# EAGLE design R284X (EAGLE 6.6.0)
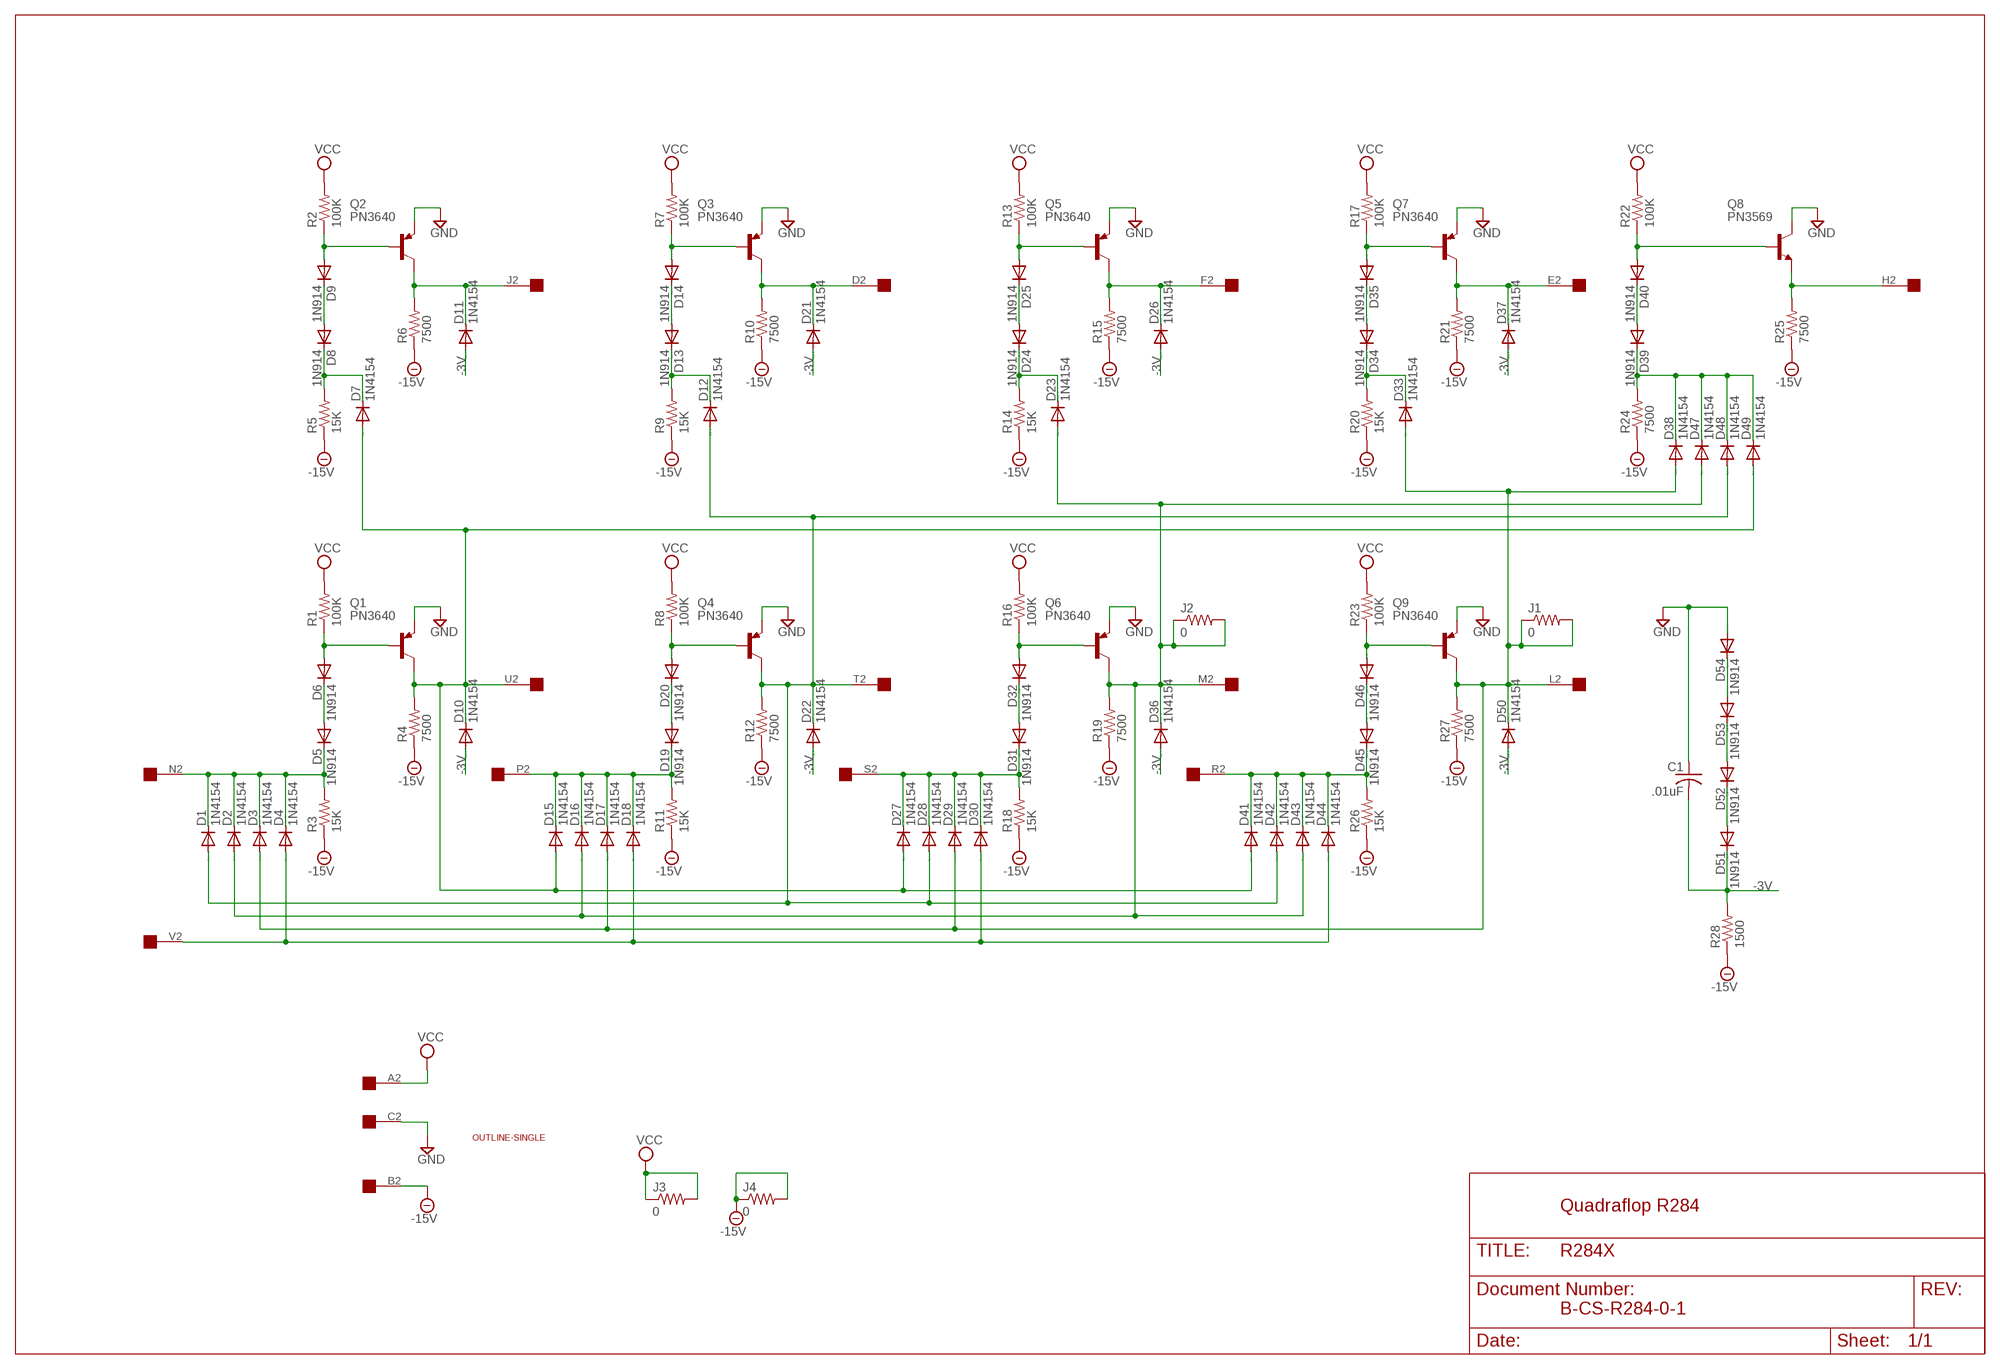
[diagram p0: schematic, sheet 1]

## Parts
C1  .01uF  C-US  [C063-025X075]
D1  1N4154  DIODE-DO35-10  [DO35-10]
D2  1N4154  DIODE-DO35-10  [DO35-10]
D3  1N4154  DIODE-DO35-10  [DO35-10]
D4  1N4154  DIODE-DO35-10  [DO35-10]
D5  1N914  DIODE-DO35-10  [DO35-10]
D6  1N914  DIODE-DO35-10  [DO35-10]
D7  1N4154  DIODE-DO35-10  [DO35-10]
D8  1N914  DIODE-DO35-10  [DO35-10]
D9  1N914  DIODE-DO35-10  [DO35-10]
D10  1N4154  DIODE-DO35-10  [DO35-10]
D11  1N4154  DIODE-DO35-10  [DO35-10]
D12  1N4154  DIODE-DO35-10  [DO35-10]
D13  1N914  DIODE-DO35-10  [DO35-10]
D14  1N914  DIODE-DO35-10  [DO35-10]
D15  1N4154  DIODE-DO35-10  [DO35-10]
D16  1N4154  DIODE-DO35-10  [DO35-10]
D17  1N4154  DIODE-DO35-10  [DO35-10]
D18  1N4154  DIODE-DO35-10  [DO35-10]
D19  1N914  DIODE-DO35-10  [DO35-10]
D20  1N914  DIODE-DO35-10  [DO35-10]
D21  1N4154  DIODE-DO35-10  [DO35-10]
D22  1N4154  DIODE-DO35-10  [DO35-10]
D23  1N4154  DIODE-DO35-10  [DO35-10]
D24  1N914  DIODE-DO35-10  [DO35-10]
D25  1N914  DIODE-DO35-10  [DO35-10]
D26  1N4154  DIODE-DO35-10  [DO35-10]
D27  1N4154  DIODE-DO35-10  [DO35-10]
D28  1N4154  DIODE-DO35-10  [DO35-10]
D29  1N4154  DIODE-DO35-10  [DO35-10]
D30  1N4154  DIODE-DO35-10  [DO35-10]
D31  1N914  DIODE-DO35-10  [DO35-10]
D32  1N914  DIODE-DO35-10  [DO35-10]
D33  1N4154  DIODE-DO35-10  [DO35-10]
D34  1N914  DIODE-DO35-10  [DO35-10]
D35  1N914  DIODE-DO35-10  [DO35-10]
D36  1N4154  DIODE-DO35-10  [DO35-10]
D37  1N4154  DIODE-DO35-10  [DO35-10]
D38  1N4154  DIODE-DO35-10  [DO35-10]
D39  1N914  DIODE-DO35-10  [DO35-10]
D40  1N914  DIODE-DO35-10  [DO35-10]
D41  1N4154  DIODE-DO35-10  [DO35-10]
D42  1N4154  DIODE-DO35-10  [DO35-10]
D43  1N4154  DIODE-DO35-10  [DO35-10]
D44  1N4154  DIODE-DO35-10  [DO35-10]
D45  1N914  DIODE-DO35-10  [DO35-10]
D46  1N914  DIODE-DO35-10  [DO35-10]
D47  1N4154  DIODE-DO35-10  [DO35-10]
D48  1N4154  DIODE-DO35-10  [DO35-10]
D49  1N4154  DIODE-DO35-10  [DO35-10]
D50  1N4154  DIODE-DO35-10  [DO35-10]
D51  1N914  DIODE-DO35-10  [DO35-10]
D52  1N914  DIODE-DO35-10  [DO35-10]
D53  1N914  DIODE-DO35-10  [DO35-10]
D54  1N914  DIODE-DO35-10  [DO35-10]
J1  0  R-US_0207/10  [0207/10]
J2  0  R-US_0207/10  [0207/10]
J3  0  R-US_0207/10  [0207/10]
J4  0  R-US_0207/10  [0207/10]
Q1  PN3640  -PNP-TO5  [TO5]
Q2  PN3640  -PNP-TO5  [TO5]
Q3  PN3640  -PNP-TO5  [TO5]
Q4  PN3640  -PNP-TO5  [TO5]
Q5  PN3640  -PNP-TO5  [TO5]
Q6  PN3640  -PNP-TO5  [TO5]
Q7  PN3640  -PNP-TO5  [TO5]
Q8  PN3569  -NPN-TO5  [TO5]
Q9  PN3640  -PNP-TO5  [TO5]
R1  100K  R-US_0207/10  [0207/10]
R2  100K  R-US_0207/10  [0207/10]
R3  15K  R-US_0207/10  [0207/10]
R4  7500  R-US_0207/10  [0207/10]
R5  15K  R-US_0207/10  [0207/10]
R6  7500  R-US_0207/10  [0207/10]
R7  100K  R-US_0207/10  [0207/10]
R8  100K  R-US_0207/10  [0207/10]
R9  15K  R-US_0207/10  [0207/10]
R10  7500  R-US_0207/10  [0207/10]
R11  15K  R-US_0207/10  [0207/10]
R12  7500  R-US_0207/10  [0207/10]
R13  100K  R-US_0207/10  [0207/10]
R14  15K  R-US_0207/10  [0207/10]
R15  7500  R-US_0207/10  [0207/10]
R16  100K  R-US_0207/10  [0207/10]
R17  100K  R-US_0207/10  [0207/10]
R18  15K  R-US_0207/10  [0207/10]
R19  7500  R-US_0207/10  [0207/10]
R20  15K  R-US_0207/10  [0207/10]
R21  7500  R-US_0207/10  [0207/10]
R22  100K  R-US_0207/10  [0207/10]
R23  100K  R-US_0207/10  [0207/10]
R24  7500  R-US_0207/10  [0207/10]
R25  7500  R-US_0207/10  [0207/10]
R26  15K  R-US_0207/10  [0207/10]
R27  7500  R-US_0207/10  [0207/10]
R28  1500  R-US_0207/10  [0207/10]
U$1  OUTLINE-SINGLE  [SINGLE]
U$2  EDGE-1  [EDGE-CON1]

## Nets
-3V: C1.2 D10.A D11.A D21.A D22.A D26.A D36.A D37.A D50.A D51.C R28.2
-15V: J4.1 J4.2 R3.1 R4.1 R5.1 R6.1 R9.1 R10.1 R11.1 R12.1 R14.1 R15.1 R18.1 R19.1 R20.1 R21.1 R24.1 R25.1 R26.1 R27.1 R28.1 U$2.B2
GND: C1.1 D54.A Q1.1(E) Q2.1(E) Q3.1(E) Q4.1(E) Q5.1(E) Q6.1(E) Q7.1(E) Q8.3(C) Q9.1(E) U$2.C2
N$1: D9.A Q2.2(B) R2.1
N$2: D11.C Q2.3(C) R6.2 U$2.J2
N$3: D7.C D8.C R5.2
N$4: D8.A D9.C
N$5: D6.A Q1.2(B) R1.1
N$6: D1.C D2.C D3.C D4.C D5.C R3.2 U$2.N2
N$7: D5.A D6.C
N$8: D7.A D10.C D15.A D27.A D41.A D49.A Q1.3(C) R4.2 U$2.U2
N$9: D1.A D12.A D22.C D28.A D42.A D48.A Q4.3(C) R12.2 U$2.T2
N$10: D2.A D16.A D23.A D36.C D43.A D47.A J2.1 J2.2 Q6.3(C) R19.2 U$2.M2
N$11: D3.A D17.A D29.A D33.A D38.A D50.C J1.1 J1.2 Q9.3(C) R27.2 U$2.L2
N$12: D4.A D18.A D30.A D44.A U$2.V2
N$13: D14.A Q3.2(B) R7.1
N$14: D21.C Q3.3(C) R10.2 U$2.D2
N$15: D12.C D13.C R9.2
N$16: D13.A D14.C
N$17: D20.A Q4.2(B) R8.1
N$18: D15.C D16.C D17.C D18.C D19.C R11.2 U$2.P2
N$19: D19.A D20.C
N$21: D51.A D52.C
N$22: D52.A D53.C
N$23: D53.A D54.C
N$25: D25.A Q5.2(B) R13.1
N$26: D26.C Q5.3(C) R15.2 U$2.F2
N$27: D23.C D24.C R14.2
N$28: D24.A D25.C
N$29: D32.A Q6.2(B) R16.1
N$30: D27.C D28.C D29.C D30.C D31.C R18.2 U$2.S2
N$31: D31.A D32.C
N$37: D35.A Q7.2(B) R17.1
N$38: D37.C Q7.3(C) R21.2 U$2.E2
N$39: D33.C D34.C R20.2
N$40: D34.A D35.C
N$41: D46.A Q9.2(B) R23.1
N$42: D41.C D42.C D43.C D44.C D45.C R26.2 U$2.R2
N$43: D45.A D46.C
N$49: D40.A Q8.2(B) R22.1
N$50: Q8.1(E) R25.2 U$2.H2
N$51: D38.C D39.C D47.C D48.C D49.C R24.2
N$52: D39.A D40.C
VCC: J3.1 J3.2 R1.2 R2.2 R7.2 R8.2 R13.2 R16.2 R17.2 R22.2 R23.2 U$2.A2
Unconnected: U$2.K2

## Notes on the sheet
- Quadraflop R284
- B-CS-R284-0-1

## Library data of the parts
C1 = dec-con:C-US: Capacitors with funky DEC lead spacing.
D1-D54 = diode:DIODE-: DIODE
J1-J4 R1-R28 = rcl:R-US_: RESISTOR, American symbol
Q1-Q7 Q9 = transistor:*-PNP-: PNP Transistror
Q8 = transistor:*-NPN-: NPN Transistror BF959 corrected 2008.03.06
U$1 = dec-con:OUTLINE-*: Board outlines for DEC boards.
U$2 = dec-con:EDGE-1: Single-Sided DEC Edge Connector -- (side 2)

## Board
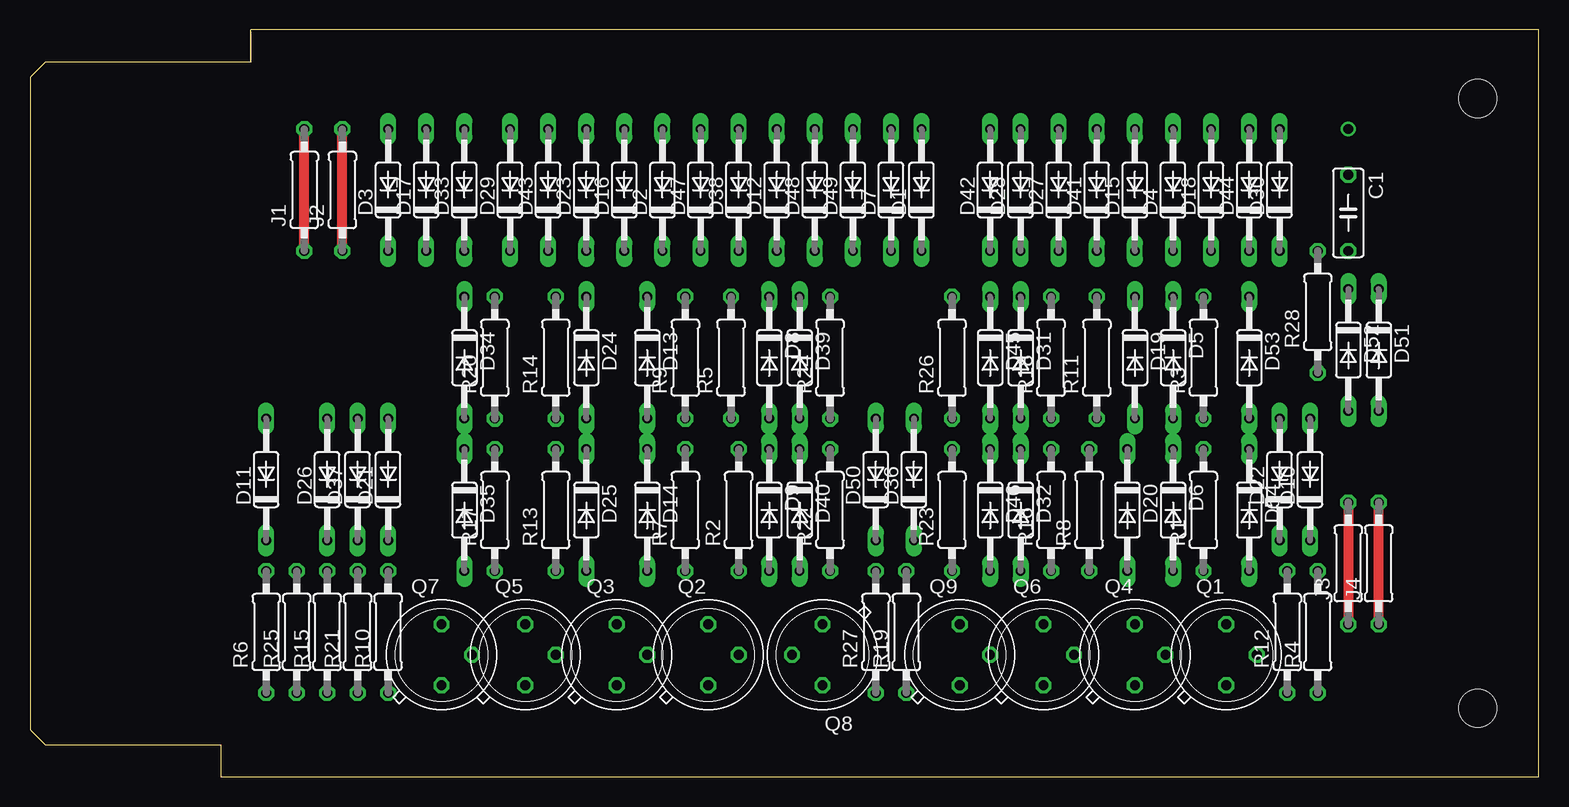
[diagram p1: board, top side]
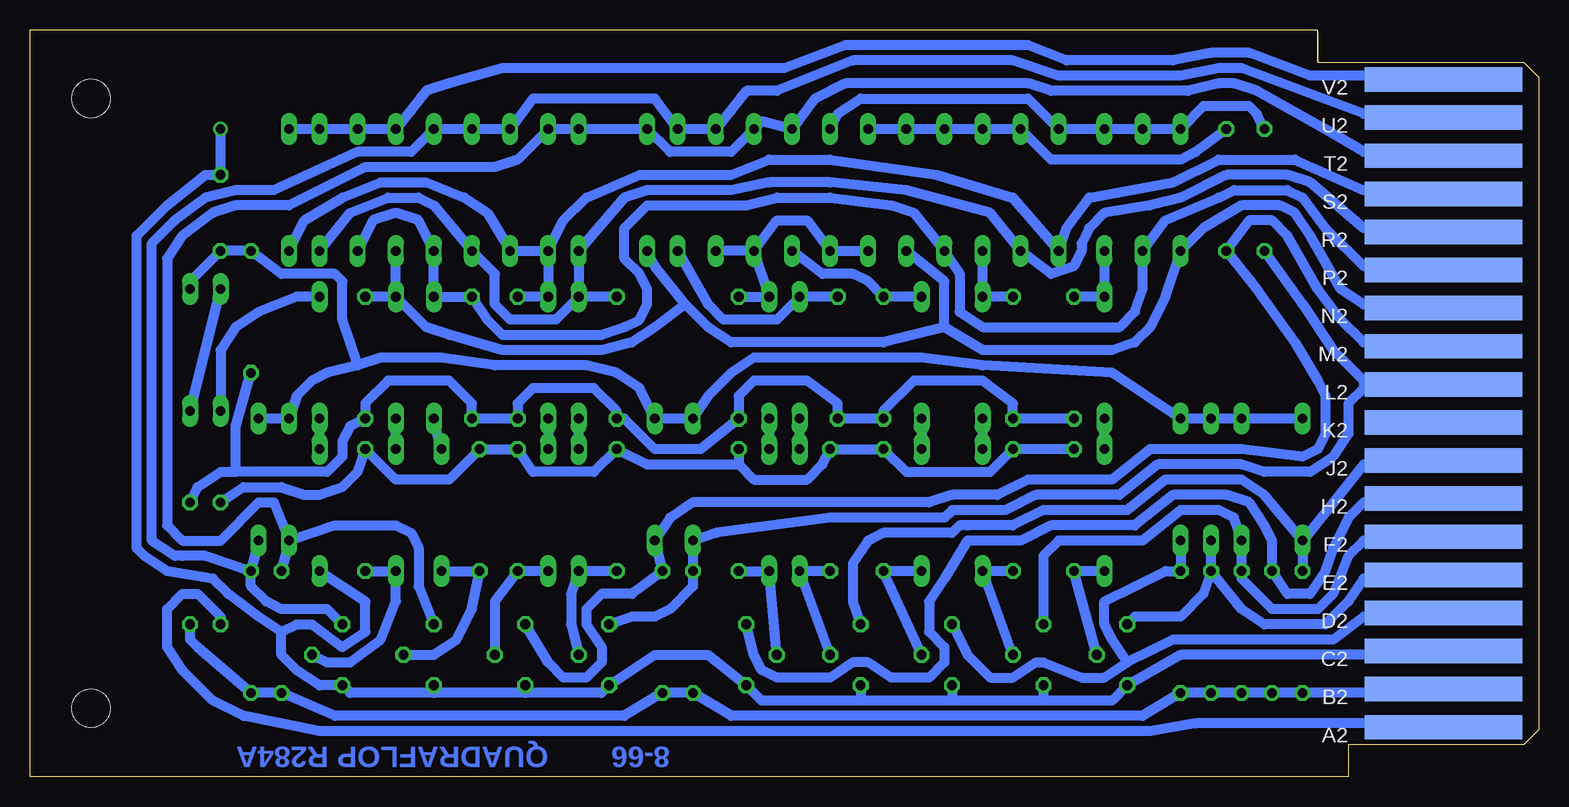
[diagram p2: board, bottom side, seen from below]

Size 125.73 x 62.23 mm. Coordinates in mm from the lower left corner, seen from the top.
Copper layers (1+16): Top 0.035mm / dielectric 1.5mm / Bottom 0.035mm
Design rules "16mils": minimum track width 16mil, minimum drill 32mil, track to track 15mil, track to pad 10mil, pad to pad 10mil, via to via 10mil, smd to smd 10mil, copper to edge 13mil, drill to drill 10mil, minimum pad ring 10mil, minimum via ring 8mil, stop-mask expansion 0mil, vias tented up to drill 0mil, thermal gap 10mil

### Footprints (pad centres in the part's own frame; a part is rotated, then mirrored left to right if it is on the bottom)
C063-025X075 = drill 0.813 octagon: 1 -2.54,0; 2 3.81,0
DO35-10 = drill 0.813 long: A 5.08,0; C -5.08,0
0207/10 = drill 0.813 octagon: 1 -5.08,0; 2 5.08,0
TO5 = drill 0.813 octagon: 1 0,-2.54; 2 2.54,0; 3 0,2.54
SINGLE = hole 3.175: 120.65,56.515; 120.65,5.715
EDGE-CON1 = smd 13.106 x 2.032 bottom: A2 7.938,4.128; B2 7.938,7.303; C2 7.938,10.477; D2 7.938,13.652; E2 7.938,16.828; F2 7.938,20.003; H2 7.938,23.177; J2 7.938,26.352; K2 7.938,29.527; L2 7.938,32.703; M2 7.938,35.877; N2 7.938,39.053; P2 7.938,42.227; R2 7.938,45.403; S2 7.938,48.578; T2 7.938,51.752; U2 7.938,54.928; V2 7.938,58.102

### Placement (x,y rotation side)
C1  109.86,47.62 270 top
D1  74.3,48.9 90 top
D2  52.71,48.9 90 top
D3  29.85,48.9 90 top
D4  95.25,48.9 90 top
D5  95.25,34.92 270 top
D6  95.25,22.23 270 top
D7  71.76,48.9 90 top
D8  61.6,34.92 270 top
D9  61.6,22.23 270 top
D10  106.68,24.77 90 top
D11  19.69,24.77 90 top
D12  62.23,48.9 90 top
D13  51.44,34.92 270 top
D14  51.44,22.23 270 top
D15  92.08,48.9 90 top
D16  49.53,48.9 90 top
D17  33.02,48.9 90 top
D18  98.43,48.9 90 top
D19  92.08,34.92 270 top
D20  91.44,22.23 270 top
D21  29.85,24.77 90 top
D22  104.14,24.77 90 top
D23  46.36,48.9 90 top
D24  46.36,34.92 270 top
D25  46.36,22.23 270 top
D26  24.77,24.77 90 top
D27  85.73,48.9 90 top
D28  82.55,48.9 90 top
D29  40.01,48.9 90 top
D30  104.14,48.9 90 top
D31  82.55,34.92 270 top
D32  82.55,22.23 270 top
D33  36.2,48.9 90 top
D34  36.2,34.92 270 top
D35  36.2,22.23 270 top
D36  73.66,24.77 90 top
D37  27.31,24.77 90 top
D38  59.06,48.9 90 top
D39  64.14,34.92 270 top
D40  64.14,22.23 270 top
D41  88.9,48.9 90 top
D42  80.01,48.9 90 top
D43  43.18,48.9 90 top
D44  101.6,48.9 90 top
D45  80.01,34.92 270 top
D46  80.01,22.23 270 top
D47  55.88,48.9 90 top
D48  65.41,48.9 90 top
D49  68.58,48.9 90 top
D50  70.49,24.77 90 top
D51  112.4,35.56 270 top
D52  109.86,35.56 270 top
D53  101.6,34.92 270 top
D54  101.6,22.23 270 top
J1  22.86,48.9 90 top
J2  26.04,48.9 90 top
J3  109.86,17.78 90 top
J4  112.4,17.78 90 top
Q1  99.7,10.16 0 top
Q2  56.52,10.16 0 top
Q3  48.9,10.16 0 top
Q4  92.08,10.16 0 top
Q5  41.28,10.16 0 top
Q6  84.46,10.16 0 top
Q7  34.29,10.16 0 top
Q8  66.04,10.16 180 top
Q9  77.47,10.16 0 top
R1  97.79,22.23 90 top
R2  59.06,22.23 90 top
R3  97.79,34.92 90 top
R4  107.32,12.06 90 top
R5  58.42,34.92 90 top
R6  19.69,12.06 90 top
R7  54.61,22.23 90 top
R8  88.27,22.23 90 top
R9  54.61,34.92 90 top
R10  29.85,12.06 90 top
R11  88.9,34.92 90 top
R12  104.78,12.06 90 top
R13  43.82,22.23 90 top
R14  43.82,34.92 90 top
R15  24.77,12.06 90 top
R16  85.09,22.23 90 top
R17  38.74,22.23 90 top
R18  85.09,34.92 90 top
R19  73.03,12.06 90 top
R20  38.74,34.92 90 top
R21  27.31,12.06 90 top
R22  66.68,22.23 90 top
R23  76.84,22.23 90 top
R24  66.68,34.92 90 top
R25  22.23,12.06 90 top
R26  76.84,34.92 90 top
R27  70.49,12.06 90 top
R28  107.32,38.73 90 top
U$1  0,0 0 top
U$2  0,0 0 top

### Tracks (layer width: path | path; a pad name or v marks a point on that pad's centre or on a via)
-3V
  Bottom 0.813: D11.A D26.A D37.A D21.A 35.56,33.66 46.36,34.29 51.44,34.92 65.41,34.92 67.31,33.66 69.22,31.75 D50.A D36.A 74.93,32.38 76.84,33.66 79.38,34.29 87,34.29 91.44,34.92 96.52,34.92 98.43,34.29 | 98.43,34.29 99.7,38.1 99.7,41.27 100.33,41.91 104.78,41.91 R28.2 C1.2 112.4,41.27 D51.C | 98.43,34.29 100.97,33.66 102.24,33.02 103.51,31.75 D22.A D10.A
-15V
  Top 0.813: J4.1 J4.2
  Bottom 0.813: U$2.B2 8.89,6.99 R6.1 R25.1 R15.1 R21.1 R10.1 33.02,5.08 67.31,5.08 R27.1 R19.1 76.2,5.08 100.33,5.08 R12.1 R4.1 111.76,10.79 112.4,11.43 J4.1 | J4.2 111.76,24.13 109.86,25.4 108.59,25.4 | 108.59,25.4 108.59,29.21 R28.1 | R20.1 R14.1 43.82,31.11 46.36,33.02 52.07,33.02 54.61,30.48 R9.1 R5.1 58.42,31.11 60.96,33.02 65.41,33.02 66.68,31.75 R24.1 69.85,27.3 73.66,27.3 76.2,29.84 R26.1 76.84,30.48 78.74,32.38 83.82,32.38 85.09,31.11 R18.1 R11.1 88.9,31.11 90.81,33.02 95.89,33.02 97.79,31.11 R3.1 99.06,29.21 99.7,27.94 99.7,26.67 100.97,25.4 108.59,25.4
GND  (via drill 0.81 pad 0.25)
  Bottom 0.813: U$2.C2 9.53,10.16 29.85,10.16 Q7.1 35.56,6.35 41.28,6.35 | 41.28,6.35 48.9,6.35 | 48.9,6.35 56.52,6.35 | 56.52,6.35 64.77,6.35 Q8.3 69.22,10.16 73.66,10.16 Q9.1 78.11,6.99 84.46,6.99 | Q3.1 48.9,6.35 | Q5.1 41.28,6.35 | Q2.1 56.52,6.35 | 84.46,6.99 92.08,6.99 | 92.08,6.99 99.06,6.99 Q1.1 101.6,7.62 103.51,8.89 104.78,10.16 104.78,12.06 | Q6.1 84.46,6.99 | Q4.1 92.08,6.99 | 104.78,12.06 103.51,12.7 102.24,12.7 99.7,10.79 97.79,12.06 97.79,14.61 D54.A | 104.78,12.06 106.68,13.34 109.22,15.24 110.49,16.51 114.3,17.14 116.21,18.41 116.84,19.05 116.84,44.45 116.84,45.09 116.21,45.72 114.3,47.62 111.13,50.16 C1.1 v109.86,53.98
N$1
  Bottom 0.813: R2.1 D9.A Q2.2
N$2
  Bottom 0.813: U$2.J2 8.89,26.04 14.61,26.04 D11.C | D11.C R6.2 | D11.C 22.86,23.5 24.77,24.77 31.12,24.77 34.29,22.23 41.28,22.23 43.82,20.95 47.63,20.95 48.26,20.95 48.9,20.32 54.61,20.32 55.88,19.68 57.15,17.78 57.15,14.61 Q2.3
N$3
  Bottom 0.813: R5.2 D8.C 63.5,38.1 67.95,38.1 69.22,39.37 D7.C
N$4
  Bottom 0.813: D9.C D8.A
N$5
  Bottom 0.813: Q1.2 100.97,9.53 99.06,9.53 96.52,11.43 95.25,14.61 D6.A R1.1
N$6
  Bottom 0.813: U$2.N2 8.89,39.37 14.61,39.37 16.51,40.64 19.05,45.09 20.32,46.99 21.59,47.62 24.77,47.62 27.94,45.72 D3.C 31.12,40.01 32.39,37.47 33.66,36.2 35.56,35.56 46.36,35.56 49.53,37.47 | 49.53,37.47 49.53,41.27 D2.C | 49.53,37.47 54.61,36.2 67.31,36.2 69.22,37.47 71.12,39.37 | 71.12,39.37 73.66,37.47 75.57,36.2 78.11,35.56 86.36,35.56 90.81,36.83 92.71,37.47 D5.C | 71.12,39.37 73.66,42.55 D1.C | D5.C D4.C | D5.C R3.2
N$7
  Bottom 0.813: D6.C D5.A
N$8
  Bottom 0.813: U$2.U2 9.53,55.24 14.61,55.24 24.77,59.05 26.67,59.05 29.85,58.42 40.01,58.42 43.82,59.69 57.15,59.69 63.5,57.15 66.04,57.15 D49.A D7.A 73.66,56.52 83.82,56.52 D27.A D41.A D15.A 93.98,52.07 98.43,52.07 105.41,48.9 108.59,48.9 111.13,48.26 113.67,46.35 115.57,44.45 115.57,19.68 113.67,18.41 113.03,18.41 111.13,18.41 R4.2 | Q1.3 100.97,13.97 104.78,13.97 106.05,14.61 107.32,15.88 R4.2 | D10.C R4.2
N$9
  Bottom 0.813: U$2.T2 8.89,52.07 14.61,52.07 17.78,53.98 23.5,57.15 25.4,57.78 26.67,57.78 29.21,57.15 40.64,57.15 42.55,57.78 57.79,57.78 60.33,56.52 D12.A 64.77,54.61 D48.A 67.31,52.07 72.39,52.07 D1.A D42.A D28.A 85.09,51.44 87,50.8 97.79,50.8 104.14,47.62 108.59,47.62 110.49,46.99 113.03,45.09 114.3,43.18 114.3,20.95 113.03,19.68 109.86,19.68 106.68,22.86 105.41,22.86 D22.C | D22.C 100.33,20.95 95.25,20.95 93.98,20.32 93.35,19.05 93.35,15.88 Q4.3 | D22.C R12.2
N$10
  Top 0.813: J2.1 J2.2
  Bottom 0.813: U$2.M2 9.53,36.2 14.61,36.2 16.51,38.1 18.42,40.64 20.96,45.09 22.23,46.35 24.13,46.35 J2.1 23.5,40.64 20.32,36.2 18.42,33.02 17.78,31.75 17.78,28.57 18.42,27.3 19.69,26.67 24.77,27.3 32.39,27.3 35.56,24.77 42.55,24.77 45.09,23.5 48.9,23.5 50.8,22.86 70.49,22.86 72.39,21.59 D36.C R19.2 75.57,15.24 78.11,15.24 79.38,13.97 79.38,12.7 78.11,10.79 78.11,9.53 79.38,8.26 81.28,8.26 82.55,9.53 Q6.3 | J2.2 28.58,52.07 29.85,51.44 40.64,51.44 D43.A D23.A D16.A D2.A D47.A
N$11
  Top 0.813: J1.1 J1.2
  Bottom 0.813: U$2.L2 9.53,33.02 14.61,33.02 | 14.61,33.02 17.15,35.56 19.69,39.37 J1.1 | 14.61,33.02 14.61,32.38 15.88,31.11 15.88,28.57 17.15,26.67 19.05,25.4 22.86,25.4 24.77,26.04 31.75,26.04 34.93,23.5 41.91,23.5 44.45,22.23 47.63,22.23 48.26,22.23 48.9,22.23 49.53,21.59 59.06,21.59 68.58,20.32 D50.C R27.2 70.49,15.88 72.39,13.97 73.66,13.34 75.57,13.34 Q9.3 | J1.2 23.5,55.24 24.13,55.88 27.94,55.88 D3.A D17.A D33.A D29.A 42.55,56.52 56.52,56.52 58.42,55.24 D38.A
N$12
  Bottom 0.813: U$2.V2 10.16,58.42 19.05,58.42 24.13,60.33 27.31,60.33 30.48,59.69 39.37,59.69 42.55,60.96 57.79,60.96 62.87,59.05 86.36,59.05 90.81,57.78 92.71,57.15 D4.A D18.A D44.A D30.A
N$13
  Bottom 0.813: D14.A R7.1 Q3.2
N$14
  Bottom 0.813: U$2.D2 8.89,13.34 14.61,13.34 17.15,11.43 30.48,11.43 34.29,9.53 | 34.29,9.53 35.56,11.43 36.2,12.7 36.2,14.61 31.12,17.14 R10.2 D21.C | Q3.3 47.63,10.16 45.72,8.26 43.82,8.26 41.91,9.53 41.28,9.53 38.1,8.26 36.2,8.26 34.29,9.53
N$15
  Bottom 0.813: D13.C R9.2 55.88,41.27 57.15,41.91 59.69,41.91 D12.C
N$16
  Bottom 0.813: D13.A D14.C
N$17
  Bottom 0.813: D20.A R8.1 88.9,13.97 90.17,11.43 92.08,10.16 Q4.2
N$18
  Bottom 0.813: D18.C 97.16,46.35 95.25,46.99 93.35,46.35 D15.C D19.C R11.2 87.63,38.1 86.36,36.83 78.11,36.83 76.2,37.47 74.93,38.1 74.3,39.37 74.3,40.64 74.93,41.91 76.2,43.18 76.2,45.72 74.3,47.62 66.04,47.62 63.5,48.26 59.06,48.26 53.98,47.62 52.07,46.99 D16.C 48.26,41.91 48.26,38.73 46.36,37.47 34.93,37.47 33.66,38.73 33.02,40.64 D17.C 31.12,46.35 26.67,48.26 25.4,48.9 20.96,48.9 19.69,48.26 17.78,45.72 14.61,42.55 8.89,42.55 U$2.P2
N$19
  Bottom 0.813: D20.C D19.A
N$21
  Bottom 0.813: D51.A D52.C
N$22
  Bottom 0.813: D53.C 103.51,40.01 106.68,38.73 108.59,37.47 109.86,35.56 D52.A
N$23
  Bottom 0.813: D54.C D53.A
N$25
  Bottom 0.813: Q5.2 D25.A R13.1
N$26
  Bottom 0.813: U$2.F2 9.53,19.68 14.61,19.68 15.88,18.41 17.15,15.24 18.42,13.97 22.23,13.97 24.77,16.51 R15.2 D26.C 25.4,21.59 26.67,22.23 29.85,22.23 33.02,19.68 40.01,19.68 41.28,18.41 Q5.3
N$27
  Bottom 0.813: R14.2 D24.C D23.C
N$28
  Bottom 0.813: D25.C D24.A
N$29
  Bottom 0.813: D32.A R16.1 87,14.61 Q6.2
N$30
  Bottom 0.813: D30.C 102.87,46.35 99.7,48.26 96.52,49.53 92.71,49.53 89.54,48.26 87.63,46.99 D27.C D28.C | D28.C D31.C R18.2 | D28.C 81.28,46.35 79.38,48.26 74.93,50.16 67.31,50.16 64.14,51.44 59.06,51.44 50.17,50.16 43.82,48.26 D29.C 39.37,45.72 37.47,48.26 30.48,49.53 26.67,51.44 20.32,51.44 14.61,48.9 8.26,48.9 U$2.S2
N$31
  Bottom 0.813: D31.A D32.C
N$37
  Bottom 0.813: D35.A R17.1 Q7.2
N$38
  Bottom 0.813: U$2.E2 8.89,16.51 14.61,16.51 15.88,14.61 17.78,12.7 22.86,12.7 24.77,13.97 R21.2 | R21.2 27.94,15.24 29.85,13.34 33.66,13.34 Q7.3 | R21.2 D37.C
N$39
  Bottom 0.813: R20.2 D34.C D33.C
N$40
  Bottom 0.813: D35.C D34.A
N$41
  Bottom 0.813: R23.1 D46.A 80.65,15.24 80.65,12.7 Q9.2
N$42
  Bottom 0.813: R26.2 D45.C | D44.C 99.06,46.99 95.89,48.26 93.35,48.26 92.08,47.62 D41.C 87,41.91 87,39.37 85.73,38.1 81.92,38.1 D45.C | U$2.R2 8.89,45.72 14.61,45.72 19.05,49.53 20.96,50.16 26.04,50.16 29.85,48.26 32.39,47.62 36.2,46.99 37.47,45.72 38.1,44.45 38.1,43.81 38.74,42.55 40.64,41.91 D43.C 45.72,46.99 52.71,48.9 59.06,49.53 64.14,49.53 67.31,48.9 74.3,48.9 76.2,48.26 D42.C D45.C
N$43
  Bottom 0.813: D46.C D45.A
N$49
  Bottom 0.813: R22.1 D40.A Q8.2
N$50
  Bottom 0.813: U$2.H2 8.89,22.86 14.61,22.86 15.88,21.59 17.15,19.05 17.78,17.14 19.05,15.24 20.96,15.24 R25.2 22.23,19.68 22.86,20.95 24.13,22.86 26.04,23.5 30.48,23.5 33.66,20.95 40.64,20.95 43.18,19.68 47.63,19.68 49.53,16.51 50.8,14.61 50.8,12.06 49.53,10.79 49.53,9.53 50.8,8.26 53.98,8.26 55.88,9.53 57.15,9.53 59.06,8.26 63.5,8.26 64.77,8.89 65.41,10.16 Q8.1
N$51
  Bottom 0.813: R24.2 D39.C D48.C | D48.C D49.C | D48.C 63.5,46.35 60.96,46.35 D38.C D47.C
N$52
  Bottom 0.813: D39.A D40.C
VCC
  Top 0.813: J3.2 J3.1
  Bottom 0.813: U$2.A2 8.89,4.45 28.58,4.45 32.39,3.81 101.6,3.81 107.95,5.08 110.49,6.35 113.03,8.89 114.3,10.79 114.3,13.97 113.03,15.24 111.76,15.24 109.86,13.34 J3.1 | R17.2 R13.2 45.72,25.4 52.71,25.4 R7.2 R2.2 59.69,26.04 60.96,24.77 65.41,24.77 66.68,26.04 | R22.2 66.68,26.04 | 66.68,26.04 73.66,26.04 74.3,26.04 R23.2 78.74,25.4 83.82,25.4 R16.2 R8.2 90.81,24.77 95.25,24.77 R1.2 98.43,25.4 99.7,24.13 101.6,23.5 102.87,23.5 104.78,24.13 107.95,24.13 J3.2

### Text on the board
Bottom: 8-66 | QUADRAFLOP R284A